# EAGLE design TiNRS-O&C-Homage (EAGLE 7.7.0)

## Sheet 1 of 2
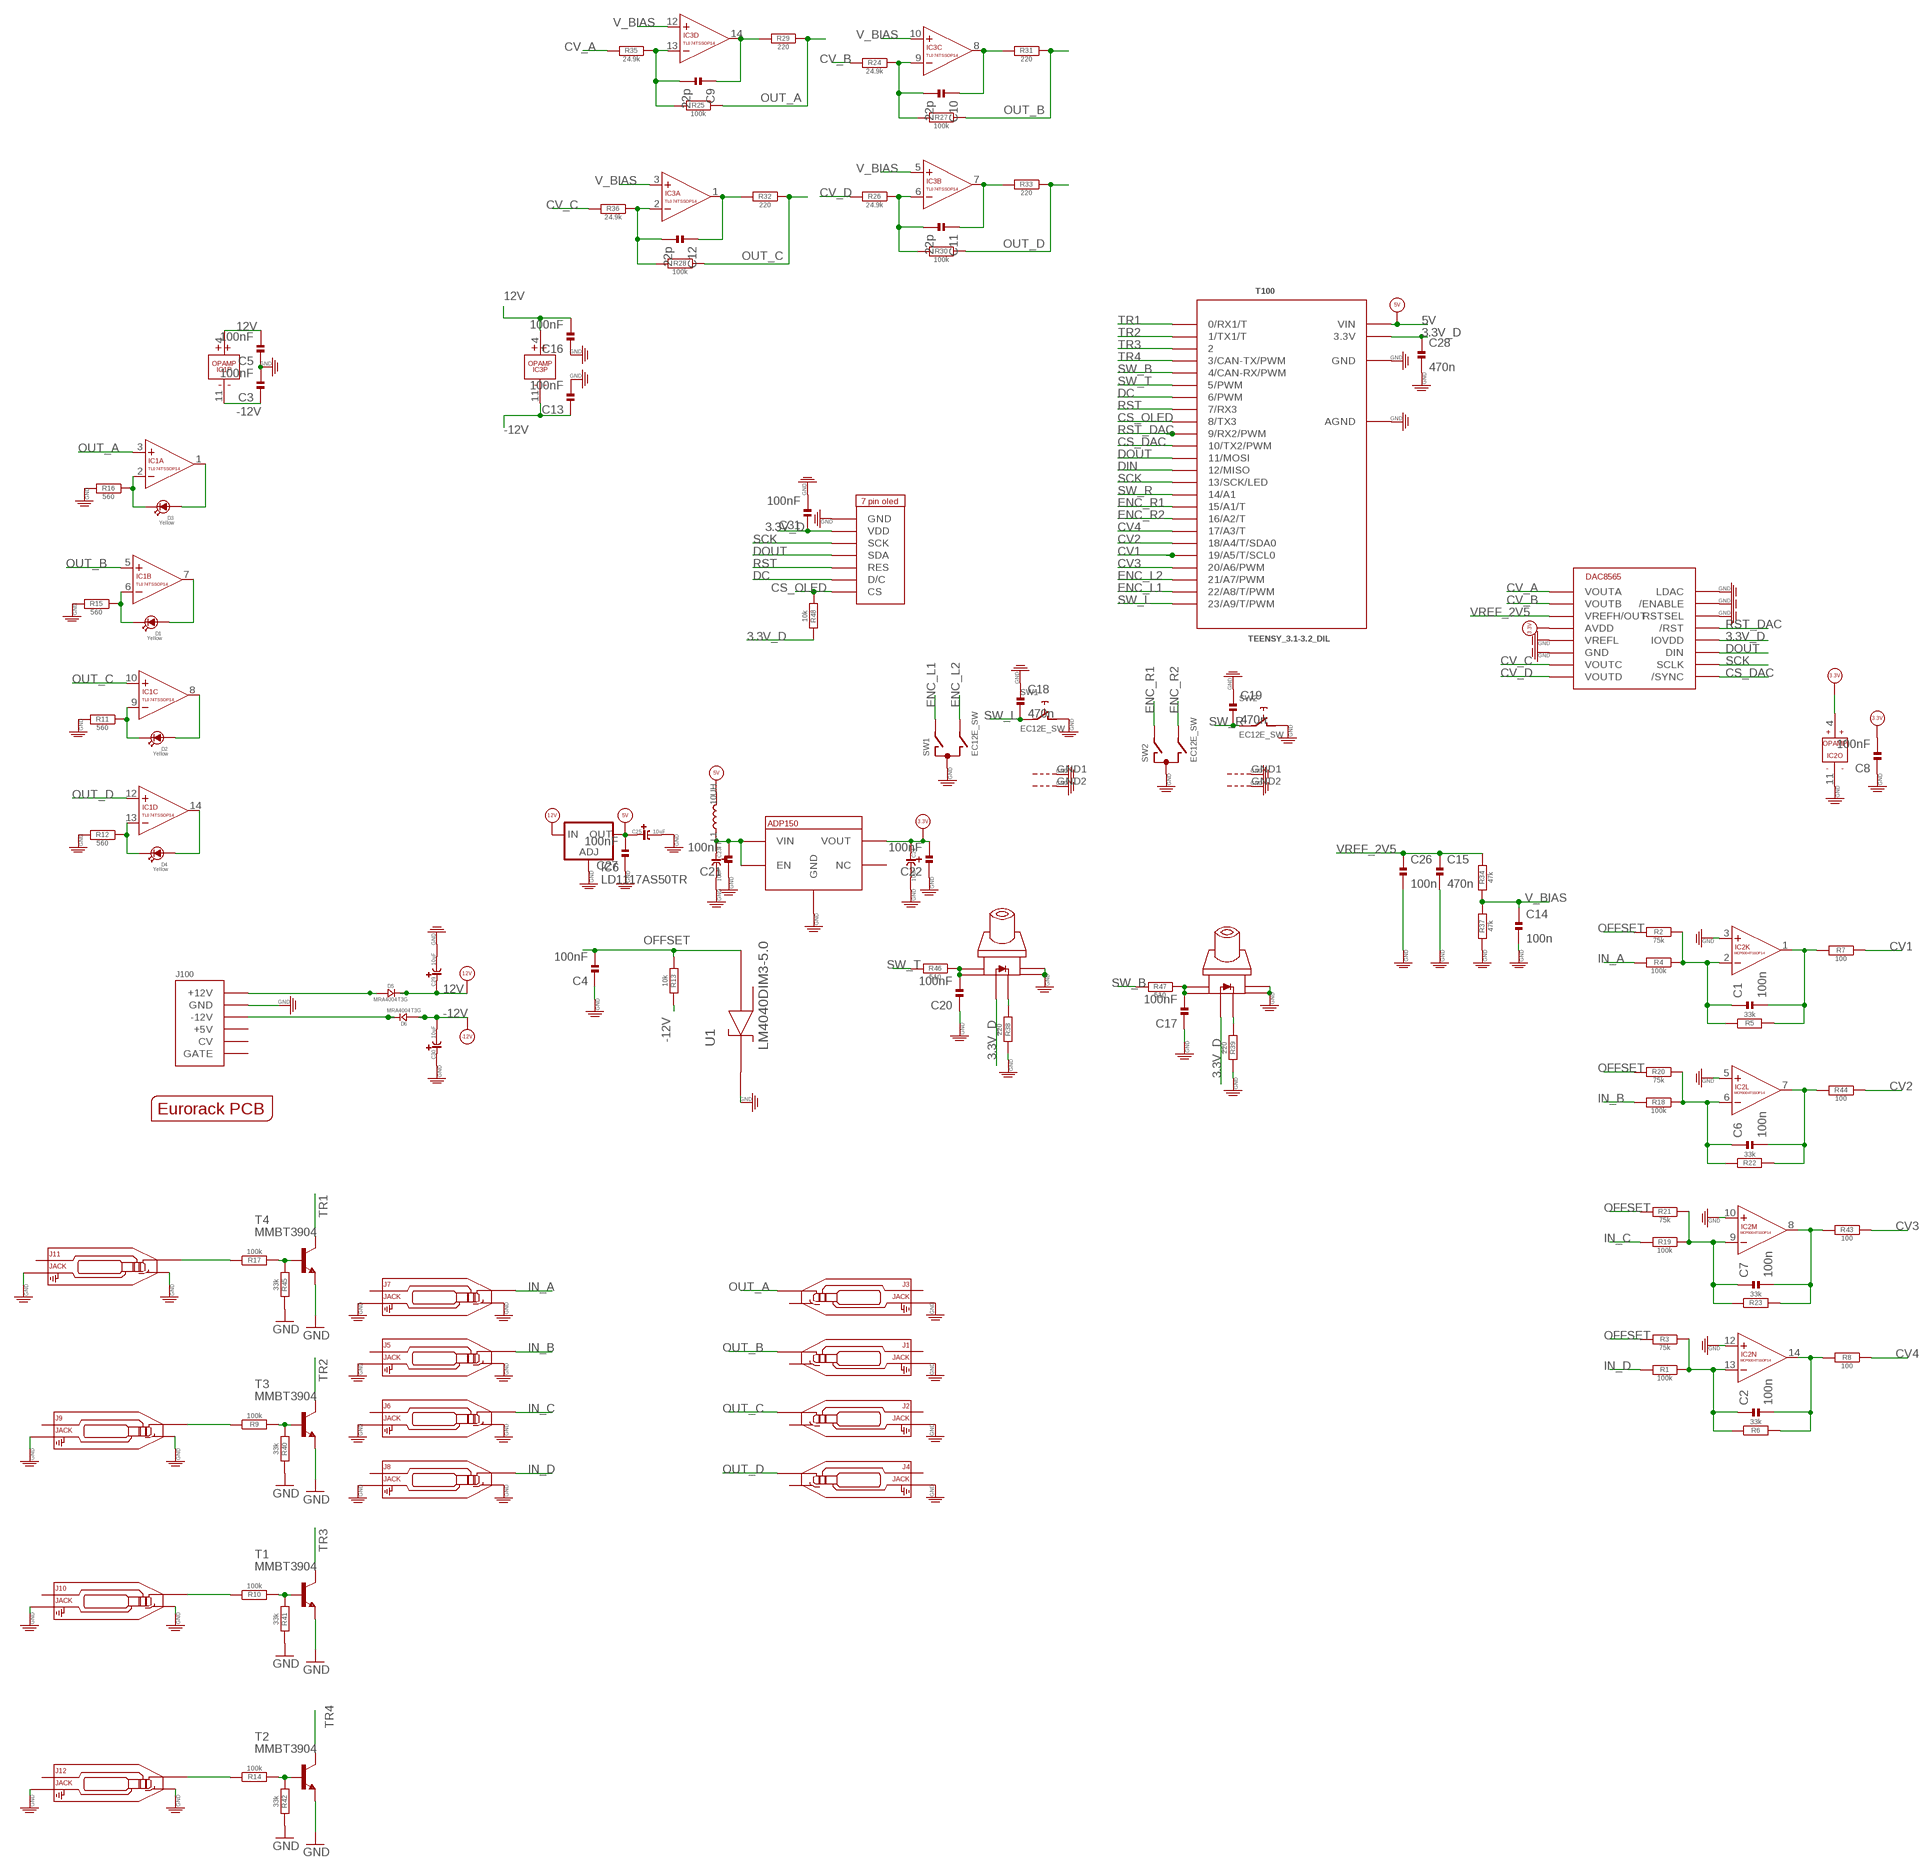
[diagram p0: schematic, sheet 1]

### Parts
C1  100n  C-EUC0402  [C0402]
C2  100n  C-EUC0402  [C0402]
C3  100nF  C-EUC0402  [C0402]
C4  100nF  C-EUC0402  [C0402]
C5  100nF  C-EUC0402  [C0402]
C6  100n  C-EUC0402  [C0402]
C7  100n  C-EUC0402  [C0402]
C8  100nF  C-EUC0402  [C0402]
C9  22p  C-EUC0402  [C0402]
C10  22p  C-EUC0402  [C0402]
C11  22p  C-EUC0402  [C0402]
C12  22p  C-EUC0402  [C0402]
C13  100nF  C-EUC0402  [C0402]
C14  100n  C-EUC0402  [C0402]
C15  470n  C-EUC0402  [C0402]
C16  100nF  C-EUC0402  [C0402]
C17  100nF  C-EUC0402  [C0402]
C18  470n  C-EUC0402  [C0402]
C19  470n  C-EUC0402  [C0402]
C20  100nF  C-EUC0402  [C0402]
C21  100nF  C-EUC0402  [C0402]
C22  100nF  C-EUC0402  [C0402]
C23  10uF  C-POLAR-A  [CASE-A_3216]
C24  10uF  C-POLAR-A  [CASE-A_3216]
C25  10uF  C-POLAR-A  [CASE-A_3216]
C26  100n  C-EUC0402  [C0402]
C27  100nF  C-EUC0402  [C0402]
C28  470n  C-EUC0402  [C0402]
C29  10uF  C-POLAR-A  [CASE-A_3216]
C30  10uF  C-POLAR-A  [CASE-A_3216]
C31  100nF  C-EUC0402  [C0402]
D1  Yellow  LED3MM  [3MMLED]
D2  Yellow  LED3MM  [3MMLED]
D3  Yellow  LED3MM  [3MMLED]
D4  Yellow  LED3MM  [3MMLED]
D5  MRA4004T3G  D-SMA  [DO-214AC]
D6  MRA4004T3G  D-SMA  [DO-214AC]
IC1  TL074TSSOP14  [TSSOP14]
IC2  MCP6004TSSOP14  [TSSOP14]
IC3  TL074TSSOP14  [TSSOP14]
IC4  ADP1503.3  [SOT-23-5]
IC5  DAC8565  [TSSOP-16]
IC6  LD1117AS50TR  [SOT223]
J1  JACK  AUDIO-JACK_SMALLSYMBOL  [3.5MM-JACK-SWITCH-13MM-NOHOLES-TESTPAD]
J2  JACK  AUDIO-JACK_SMALLSYMBOL  [3.5MM-JACK-SWITCH-13MM-NOHOLES-TESTPAD]
J3  JACK  AUDIO-JACK_SMALLSYMBOL  [3.5MM-JACK-SWITCH-13MM-NOHOLES-TESTPAD]
J4  JACK  AUDIO-JACK_SMALLSYMBOL  [3.5MM-JACK-SWITCH-13MM-NOHOLES-TESTPAD]
J5  JACK  AUDIO-JACK_SMALLSYMBOL  [3.5MM-JACK-SWITCH-13MM-NOHOLES-TESTPAD]
J6  JACK  AUDIO-JACK_SMALLSYMBOL  [3.5MM-JACK-SWITCH-13MM-NOHOLES-TESTPAD]
J7  JACK  AUDIO-JACK_SMALLSYMBOL  [3.5MM-JACK-SWITCH-13MM-NOHOLES-TESTPAD]
J8  JACK  AUDIO-JACK_SMALLSYMBOL  [3.5MM-JACK-SWITCH-13MM-NOHOLES-TESTPAD]
J9  JACK  AUDIO-JACK_SMALLSYMBOL  [3.5MM-JACK-SWITCH-13MM-NOHOLES-TESTPAD]
J10  JACK  AUDIO-JACK_SMALLSYMBOL  [3.5MM-JACK-SWITCH-13MM-NOHOLES-TESTPAD]
J11  JACK  AUDIO-JACK_SMALLSYMBOL  [3.5MM-JACK-SWITCH-13MM-NOHOLES-TESTPAD]
J12  JACK  AUDIO-JACK_SMALLSYMBOL  [3.5MM-JACK-SWITCH-13MM-NOHOLES-TESTPAD]
J100  POWER_SHROUDED_NOTEXT  [POWER_16_SHROUDED_NOTEXT]
L1  10UH  L-0805  [L0805]
OLED1  7PIN_SPI_OLED1.3"  [1.3"_7PIN_OLED]
PCB1  EURORACK_PCB8HP  [EURORACK8HPPCB]
R1  100k  R-EU_R0402  [R0402]
R2  75k  R-EU_R0402  [R0402]
R3  75k  R-EU_R0402  [R0402]
R4  100k  R-EU_R0402  [R0402]
R5  33k  R-EU_R0402  [R0402]
R6  33k  R-EU_R0402  [R0402]
R7  100  R-EU_R0402  [R0402]
R8  100  R-EU_R0402  [R0402]
R9  100k  R-EU_R0402  [R0402]
R10  100k  R-EU_R0402  [R0402]
R11  560  R-EU_R0402  [R0402]
R12  560  R-EU_R0402  [R0402]
R13  10k  R-EU_R0402  [R0402]
R14  100k  R-EU_R0402  [R0402]
R15  560  R-EU_R0402  [R0402]
R16  560  R-EU_R0402  [R0402]
R17  100k  R-EU_R0402  [R0402]
R18  100k  R-EU_R0402  [R0402]
R19  100k  R-EU_R0402  [R0402]
R20  75k  R-EU_R0402  [R0402]
R21  75k  R-EU_R0402  [R0402]
R22  33k  R-EU_R0402  [R0402]
R23  33k  R-EU_R0402  [R0402]
R24  24.9k  R-EU_R0402  [R0402]
R25  100k  R-EU_R0402  [R0402]
R26  24.9k  R-EU_R0402  [R0402]
R27  100k  R-EU_R0402  [R0402]
R28  100k  R-EU_R0402  [R0402]
R29  220  R-EU_R0402  [R0402]
R30  100k  R-EU_R0402  [R0402]
R31  220  R-EU_R0402  [R0402]
R32  220  R-EU_R0402  [R0402]
R33  220  R-EU_R0402  [R0402]
R34  47k  R-EU_R0402  [R0402]
R35  24.9k  R-EU_R0402  [R0402]
R36  24.9k  R-EU_R0402  [R0402]
R37  47k  R-EU_R0402  [R0402]
R38  220  R-EU_R0402  [R0402]
R39  220  R-EU_R0402  [R0402]
R40  33k  R-EU_R0402  [R0402]
R41  33k  R-EU_R0402  [R0402]
R42  33k  R-EU_R0402  [R0402]
R43  100  R-EU_R0402  [R0402]
R44  100  R-EU_R0402  [R0402]
R45  33k  R-EU_R0402  [R0402]
R46  510  R-EU_R0402  [R0402]
R47  510  R-EU_R0402  [R0402]
R48  10k  R-EU_R0402  [R0402]
S1  SWITCH_W_LED_PB6149L-X-102YELLOW  [PB6149L]
S2  SWITCH_W_LED_PB6149L-X-102YELLOW  [PB6149L]
SW1  EC12E_SW  [ALPS_EC12E_SW]
SW2  EC12E_SW  [ALPS_EC12E_SW]
T1  MMBT3904  MMBT3904LT1-NPN-SOT23-BEC  [SOT23-BEC]
T2  MMBT3904  MMBT3904LT1-NPN-SOT23-BEC  [SOT23-BEC]
T3  MMBT3904  MMBT3904LT1-NPN-SOT23-BEC  [SOT23-BEC]
T4  MMBT3904  MMBT3904LT1-NPN-SOT23-BEC  [SOT23-BEC]
T100  TEENSY_3.1-3.2_DIL  [TEENSY_3.0-3.2&LC_DIL]
U1  LM4040DIM3-5.0  [SOT95P237X112-3N]

### Nets
3.3V [heavypower]: C8.2 C22.2 C24.+ IC2.4(O:V+) IC4.5(VOUT) IC5.P$4(AVDD)
3.3V_D [heavypower]: C28.1 C31.1 IC5.P$12(IOVDD) OLED1.P$2(VDD) R48.1 S1.LEDPOS(POS) S2.LEDPOS(POS) T100.3.3V
5V [heavypower]: C25.+ C27.2 IC6.2(OUT) IC6.4(OUT) L1.2 T100.VIN
12V [heavypower]: C5.2 C16.2 C29.+ D5.2(-) IC1.4(P:V+) IC3.4(P:V+) IC6.3(IN)
-12V [heavypower]: C3.1 C13.1 C30.- D6.1(+) IC1.11(P:V-) IC3.11(P:V-) R13.1
CS_DAC: IC5.P$9(/SYNC) T100.10(10/TX2/PWM)
CS_OLED: OLED1.P$7(CS) R48.2 T100.8(8/TX3)
CV1: R7.1 T100.19/A5(19/A5/T/SCL0)
CV2: R44.1 T100.18/A4(18/A4/T/SDA0)
CV3: R43.1 T100.20/A6(20/A6/PWM)
CV4: R8.1 T100.17/A3(17/A3/T)
CV_A: IC5.P$1(VOUTA) R35.2
CV_B: IC5.P$2(VOUTB) R24.2
CV_C: IC5.P$7(VOUTC) R36.2
CV_D: IC5.P$8(VOUTD) R26.2
DC: OLED1.P$6(D/C) T100.6(6/PWM)
DIN: T100.12(12/MISO)
DOUT: IC5.P$11(DIN) OLED1.P$4(SDA) T100.11(11/MOSI)
ENC_L1: SW1.A T100.22/A8(22/A8/T/PWM)
ENC_L2: SW1.B T100.21/A7(21/A7/PWM)
ENC_R1: SW2.A T100.15/A1(15/A1/T)
ENC_R2: SW2.B T100.16/A2(16/A2/T)
GND: C3.2 C4.1 C5.1 C8.1 C13.2 C14.2 C15.2 C16.1 C17.1 C18.1 C19.1 C20.1 C21.1 C22.1 C23.- C24.- C25.- C26.2 C27.1 C28.2 C29.- C30.+ C31.2 IC2.3(K:+IN) IC2.5(L:+IN) IC2.10(M:+IN) IC2.11(O:V-) IC2.12(N:+IN) IC4.2(GND) IC5.P$5(VREFL) IC5.P$6(GND) IC5.P$14(RSTSEL) IC5.P$15(/ENABLE) IC5.P$16(LDAC) IC6.1(ADJ) J1.RING_B@1(RING) J1.RING_T@3(RING) J2.RING_B@1(RING) J2.RING_T@3(RING) J3.RING_B@1(RING) J3.RING_T@3(RING) J4.RING_B@1(RING) J4.RING_T@3(RING) J5.RING_B@1(RING) J5.RING_T@3(RING) J5.SWITCH_B@1(SWITCH) J5.SWITCH_T@3(SWITCH) J6.RING_B@1(RING) J6.RING_T@3(RING) J6.SWITCH_B@1(SWITCH) J6.SWITCH_T@3(SWITCH) J7.RING_B@1(RING) J7.RING_T@3(RING) J7.SWITCH_B@1(SWITCH) J7.SWITCH_T@3(SWITCH) J8.RING_B@1(RING) J8.RING_T@3(RING) J8.SWITCH_B@1(SWITCH) J8.SWITCH_T@3(SWITCH) J9.RING_B@1(RING) J9.RING_T@3(RING) J9.SWITCH_B@1(SWITCH) J9.SWITCH_T@3(SWITCH) J10.RING_B@1(RING) J10.RING_T@3(RING) J10.SWITCH_B@1(SWITCH) J10.SWITCH_T@3(SWITCH) J11.RING_B@1(RING) J11.RING_T@3(RING) J11.SWITCH_B@1(SWITCH) J11.SWITCH_T@3(SWITCH) J12.RING_B@1(RING) J12.RING_T@3(RING) J12.SWITCH_B@1(SWITCH) J12.SWITCH_T@3(SWITCH) J100.3(GND) J100.4(GND) J100.5(GND) J100.6(GND) J100.7(GND) J100.8(GND) OLED1.P$1(GND) R11.2 R12.2 R15.2 R16.2 R37.2 R38.1 R39.1 R40.1 R41.1 R42.1 R45.1 S1.3 S1.4 S2.3 S2.4 SW1.C SW1.D SW1.GND1(G) SW1.GND2(G) SW2.C SW2.D SW2.GND1(G) SW2.GND2(G) T1.E T2.E T3.E T4.E T100.AGND T100.GND U1.1(CATHODE)
IN_A: J7.TIP_B@1(TIP) J7.TIP_T@3(TIP) R4.2
IN_B: J5.TIP_B@1(TIP) J5.TIP_T@3(TIP) R18.2
IN_C: J6.TIP_B@1(TIP) J6.TIP_T@3(TIP) R19.2
IN_D: J8.TIP_B@1(TIP) J8.TIP_T@3(TIP) R1.2
N$1: R38.2 S1.LEDNEG(NEG)
N$2: R39.2 S2.LEDNEG(NEG)
N$3: C20.2 R46.1 S1.1 S1.2
N$4: C17.2 R47.1 S2.1 S2.2
N$6: R17.2 R45.2 T4.B
N$7: R9.2 R40.2 T3.B
N$8: J11.TIP_B@1(TIP) J11.TIP_T@3(TIP) R17.1
N$9: J9.TIP_B@1(TIP) J9.TIP_T@3(TIP) R9.1
N$10: R10.2 R41.2 T1.B
N$11: J10.TIP_B@1(TIP) J10.TIP_T@3(TIP) R10.1
N$12: R14.2 R42.2 T2.B
N$13: J12.TIP_B@1(TIP) J12.TIP_T@3(TIP) R14.1
N$14: C12.2 IC3.2(A:-IN) R28.2 R36.1
N$15: C12.1 IC3.1(A:OUT) R32.2
N$16: D1.- IC1.6(B:-IN) R15.1
N$17: C11.2 IC3.6(B:-IN) R26.1 R30.2
N$18: C11.1 IC3.7(B:OUT) R33.2
N$19: D1.+ IC1.7(B:OUT)
N$20: C10.2 IC3.9(C:-IN) R24.1 R27.2
N$21: C10.1 IC3.8(C:OUT) R31.2
N$22: D2.- IC1.9(C:-IN) R11.1
N$23: C9.2 IC3.13(D:-IN) R25.2 R35.1
N$24: C9.1 IC3.14(D:OUT) R29.2
N$25: D2.+ IC1.8(C:OUT)
N$26: D4.- IC1.13(D:-IN) R12.1
N$27 [heavypower]: C21.2 C23.+ IC4.1(VIN) IC4.3(EN) L1.1
N$28 [heavypower]: D5.1(+) J100.9(+12V) J100.10(+12V)
N$29: D4.+ IC1.14(D:OUT)
N$30: C6.2 IC2.7(L:OUT) R22.2 R44.2
N$31: C1.2 IC2.1(K:OUT) R5.2 R7.2
N$32: C1.1 IC2.2(K:-IN) R2.1 R4.1 R5.1
N$33: C6.1 IC2.6(L:-IN) R18.1 R20.1 R22.1
N$35: C7.2 IC2.8(M:OUT) R23.2 R43.2
N$37: C7.1 IC2.9(M:-IN) R19.1 R21.1 R23.1
N$38: C2.2 IC2.14(N:OUT) R6.2 R8.2
N$39: C2.1 IC2.13(N:-IN) R1.1 R3.1 R6.1
N$44: D3.- IC1.2(A:-IN) R16.1
N$64 [heavypower]: D6.2(-) J100.1(-12V) J100.2(-12V)
N$77: D3.+ IC1.1(A:OUT)
OFFSET [heavypower]: C4.2 R2.2 R3.2 R13.2 R20.2 R21.2 U1.2(ANODE)
OUT_A: IC1.3(A:+IN) J3.TIP_B@1(TIP) J3.TIP_T@3(TIP) R25.1 R29.1
OUT_B: IC1.5(B:+IN) J1.TIP_B@1(TIP) J1.TIP_T@3(TIP) R27.1 R31.1
OUT_C: IC1.10(C:+IN) J2.TIP_B@1(TIP) J2.TIP_T@3(TIP) R28.1 R32.1
OUT_D: IC1.12(D:+IN) J4.TIP_B@1(TIP) J4.TIP_T@3(TIP) R30.1 R33.1
RST: OLED1.P$5(RES) T100.7(7/RX3)
RST_DAC: IC5.P$13(/RST) T100.9(9/RX2/PWM)
SCK: IC5.P$10(SCLK) OLED1.P$3(SCK) T100.13(13/SCK/LED)
SW_B: R47.2 T100.4(4/CAN-RX/PWM)
SW_L: C18.2 SW1.E T100.23/A9(23/A9/T/PWM)
SW_R: C19.2 SW2.E T100.14/A0(14/A1)
SW_T: R46.2 T100.5(5/PWM)
TR1: T4.C T100.0(0/RX1/T)
TR2: T3.C T100.1(1/TX1/T)
TR3: T1.C T100.2
TR4: T2.C T100.3(3/CAN-TX/PWM)
V_BIAS: C14.1 IC3.3(A:+IN) IC3.5(B:+IN) IC3.10(C:+IN) IC3.12(D:+IN) R34.2 R37.1
VREF_2V5: C15.1 C26.1 IC5.P$3(VREFH/OUT) R34.1
Unconnected: IC4.4(NC) J1.SECOND_B@1(SECOND) J1.SECOND_T@3(SECOND) J1.SWITCH_B@1(SWITCH) J1.SWITCH_T@3(SWITCH) J2.SECOND_B@1(SECOND) J2.SECOND_T@3(SECOND) J2.SWITCH_B@1(SWITCH) J2.SWITCH_T@3(SWITCH) J3.SECOND_B@1(SECOND) J3.SECOND_T@3(SECOND) J3.SWITCH_B@1(SWITCH) J3.SWITCH_T@3(SWITCH) J4.SECOND_B@1(SECOND) J4.SECOND_T@3(SECOND) J4.SWITCH_B@1(SWITCH) J4.SWITCH_T@3(SWITCH) J5.SECOND_B@1(SECOND) J5.SECOND_T@3(SECOND) J6.SECOND_B@1(SECOND) J6.SECOND_T@3(SECOND) J7.SECOND_B@1(SECOND) J7.SECOND_T@3(SECOND) J8.SECOND_B@1(SECOND) J8.SECOND_T@3(SECOND) J9.SECOND_B@1(SECOND) J9.SECOND_T@3(SECOND) J10.SECOND_B@1(SECOND) J10.SECOND_T@3(SECOND) J11.SECOND_B@1(SECOND) J11.SECOND_T@3(SECOND) J12.SECOND_B@1(SECOND) J12.SECOND_T@3(SECOND) J100.11(+5V) J100.12(+5V) J100.13(CV) J100.14(CV) J100.15(GATE) J100.16(GATE) U1.3(NC)

## Sheet 2 of 2

## Library data of the parts
C1-C3 C5-C7 C9-C16 C18 C19 C26 C28 = resistor:C-EU: CAPACITOR, European symbol
C4 C8 C17 C20-C22 C27 C31 = resistor:C-EU: CAPACITOR, European symbol; MF: AVX; MPN: 06035C104KAT2A; OC_FARNELL: 1301804
C23-C25 C29 C30 = EurorackModularParts:C-POLAR*
D1 = EurorackModularParts:LED*: LED; DESC: B
D2 = EurorackModularParts:LED*: LED; DESC: C
D3 = EurorackModularParts:LED*: LED; DESC: A
D4 = EurorackModularParts:LED*: LED; DESC: D
D5 D6 = OPL:D*: DIODE; MF: VISHAY; MPN: US1G-E3/5AT; OC_FARNELL: 9551824
IC1 IC3 = EurorackModularParts:TL074: OP AMP
IC2 = EurorackModularParts:MCP6004
IC4 = zephod-components:ADP150
IC5 = zephod-components:DAC8565
IC6 = ld-components:LD1117A?*: Low drop fixed and adjustable positive voltage regulators 1 A Source: http://www.st.com/stonline/products/literature/ds/7194/ld1117axx.pdf
J1 = EurorackModularParts:AUDIO-JACK_SMALLSYMBOL: Switching Mono 3.5mm Audio Jack from Erthenvar.; DESC: O 2
J2 = EurorackModularParts:AUDIO-JACK_SMALLSYMBOL: Switching Mono 3.5mm Audio Jack from Erthenvar.; DESC: O 3
J3 = EurorackModularParts:AUDIO-JACK_SMALLSYMBOL: Switching Mono 3.5mm Audio Jack from Erthenvar.; DESC: O 1
J4 = EurorackModularParts:AUDIO-JACK_SMALLSYMBOL: Switching Mono 3.5mm Audio Jack from Erthenvar.; DESC: O 4
J5 = EurorackModularParts:AUDIO-JACK_SMALLSYMBOL: Switching Mono 3.5mm Audio Jack from Erthenvar.; DESC: C 2
J6 = EurorackModularParts:AUDIO-JACK_SMALLSYMBOL: Switching Mono 3.5mm Audio Jack from Erthenvar.; DESC: C 3
J7 = EurorackModularParts:AUDIO-JACK_SMALLSYMBOL: Switching Mono 3.5mm Audio Jack from Erthenvar.; DESC: C 1
J8 = EurorackModularParts:AUDIO-JACK_SMALLSYMBOL: Switching Mono 3.5mm Audio Jack from Erthenvar.; DESC: C 4
J9 = EurorackModularParts:AUDIO-JACK_SMALLSYMBOL: Switching Mono 3.5mm Audio Jack from Erthenvar.; DESC: G 2
J10 = EurorackModularParts:AUDIO-JACK_SMALLSYMBOL: Switching Mono 3.5mm Audio Jack from Erthenvar.; DESC: G 3
J11 = EurorackModularParts:AUDIO-JACK_SMALLSYMBOL: Switching Mono 3.5mm Audio Jack from Erthenvar.; DESC: G 1
J12 = EurorackModularParts:AUDIO-JACK_SMALLSYMBOL: Switching Mono 3.5mm Audio Jack from Erthenvar.; DESC: G 4
J100 = EurorackModularParts:POWER
L1 = OPL:L*
OLED1 = zephod-components:7PIN_SPI_OLED
PCB1 = EurorackModularParts:EURORACK_PCB
R1-R48 = resistor:R-EU_: RESISTOR, European symbol; OC_FARNELL: unknown
S1 S2 = zephod-components:SWITCH_W_LED_PB6149L-X-102
SW1 SW2 = switch-alps:EC12E_SW: ALPS rotary Encoder EC12E series with switch; MPN: EC12E2424407; OC_FARNELL: 1520813; OC_NEWARK: 74M1068
T1-T4 = transistor:*-NPN-: NPN Transistror BF959 corrected 2008.03.06; MF: NXP; MPN: PMBT3904,215; OC_FARNELL: 2336795
T100 = Teensy_3_and_LC_Series_Boards_v1.4:TEENSY_3.1-3.2_DIL: Teensy 3.1 or 3.2 in a DIL Layout.
U1 = FarnellThings:LM4040DIM3-5.0: IC, Precision Micropower Shunt Voltage Reference, 5V,SOT-23-3; MF: TEXAS INSTRUMENTS; MPN: LM4040DIM3-5.0; OC_FARNELL: 9778330; OC_NEWARK: 97K3489; PACKAGE: SOT-23-3; SUPPLIER: TEXAS INSTRUMENTS

## Net classes
0 default: width 0.203 mm
1 heavypower: width 0.381 mm

## Board
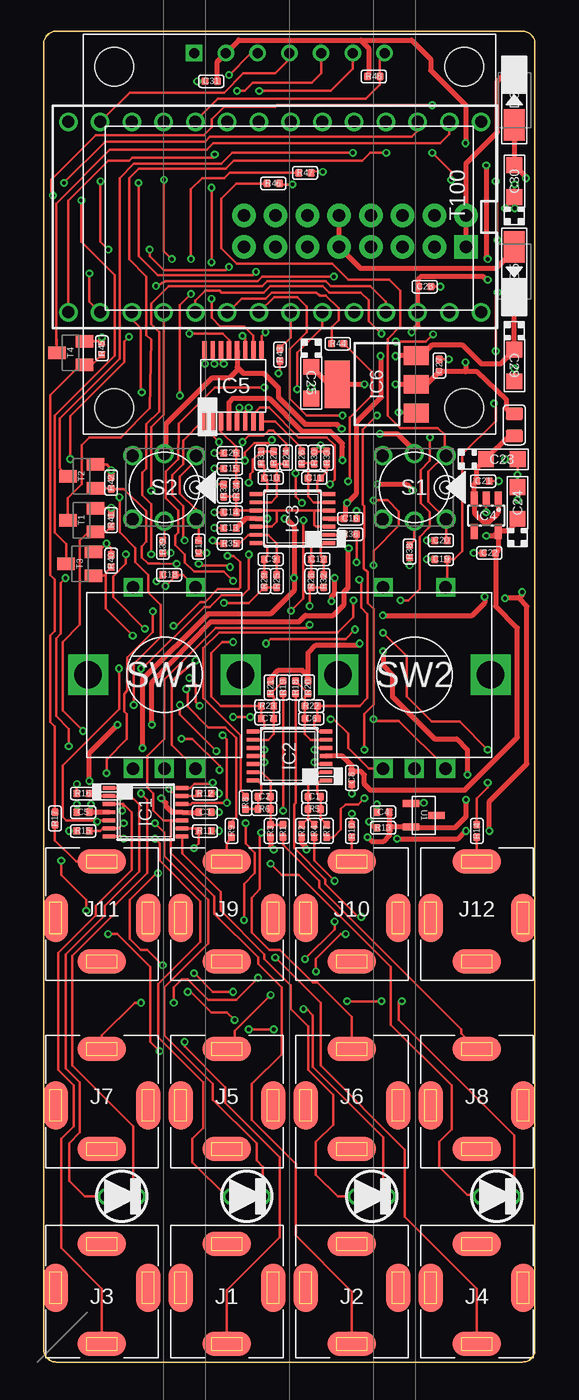
[diagram p1: board, top side]
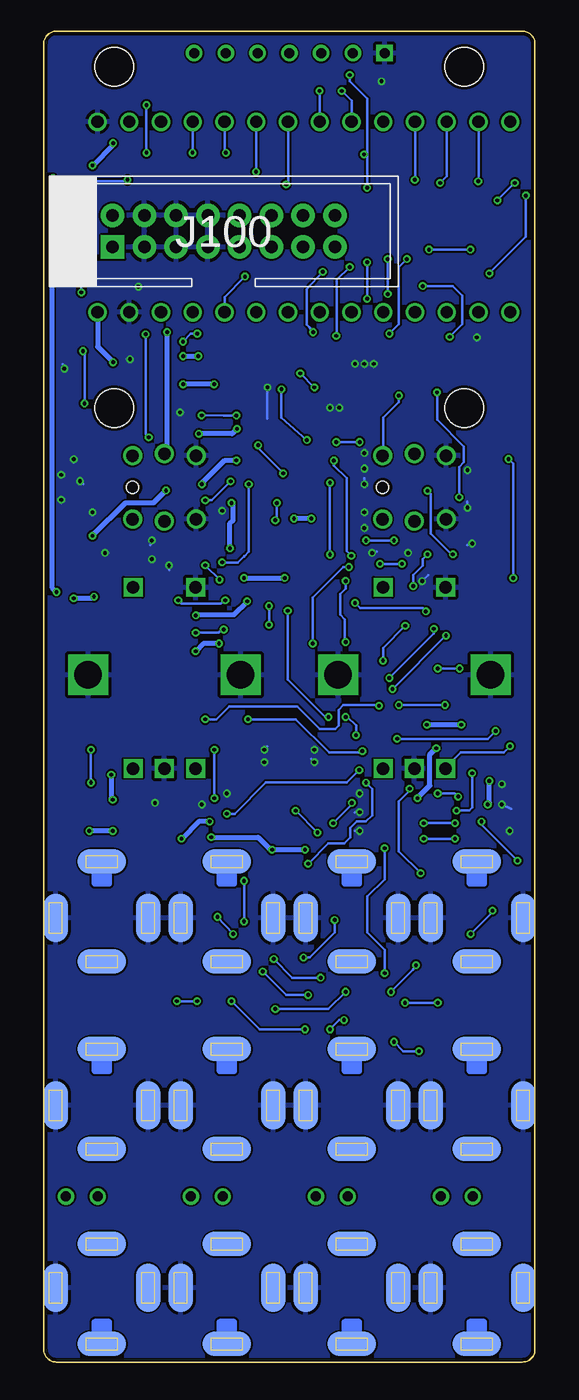
[diagram p2: board, bottom side, seen from below]

Size 39.3 x 106.5 mm. Coordinates in mm from the lower left corner, seen from the top.
Copper layers (1*16): Top 0.035mm / dielectric 1.5mm / Bottom 0.035mm
Design rules "ITEADstudio_DRC": minimum track width 6mil, minimum drill 12mil, track to track 6mil, track to pad 6mil, pad to pad 6mil, via to via 6mil, smd to smd 0mil, copper to edge 10mil, drill to drill 10mil, minimum pad ring 10mil, minimum via ring 6mil, stop-mask expansion 2mil, vias tented up to drill 100mil, thermal gap 10mil

### Footprints (pad centres in the part's own frame; a part is rotated, then mirrored left to right if it is on the bottom)
C0402 = smd 0.6 x 0.6: 1 -0.5,0; 2 0.5,0
CASE-A_3216 = smd 1.27 x 1.27: + -1.27,0; - 1.27,0
3MMLED = drill 0.8: + -1.27,0; - 1.27,0
DO-214AC = smd 2.5 x 1.7: 1 -2,0; 2 2,0
TSSOP14 = smd 0.305 x 0.991: 1 -1.95,-2.918; 2 -1.3,-2.918; 3 -0.65,-2.918; 4 0,-2.918; 5 0.65,-2.918; 6 1.3,-2.918; 7 1.95,-2.918; 8 1.95,2.918; 9 1.3,2.918; 10 0.65,2.918; 11 0,2.918; 12 -0.65,2.918; 13 -1.3,2.918; 14 -1.95,2.918
SOT-23-5 = smd 0.55 x 1.2: 1 -0.95,-1.3; 2 0,-1.3; 3 0.95,-1.3; 4 0.95,1.3; 5 -0.95,1.3
TSSOP-16 = smd 0.35 x 1.4: P$1 -2.275,-2.875; P$2 -1.625,-2.875; P$3 -0.975,-2.875; P$4 -0.325,-2.875; P$5 0.325,-2.875; P$6 0.975,-2.875; P$7 1.625,-2.875; P$8 2.275,-2.875; P$9 2.275,2.875; P$10 1.625,2.875; P$11 0.975,2.875; P$12 0.325,2.875; P$13 -0.325,2.875; P$14 -0.975,2.875; P$15 -1.625,2.875; P$16 -2.275,2.875
SOT223 = smd 1.5 x 2: 1 -2.3,-3.15; 2 0,-3.15; 3 2.3,-3.15 | smd 3.8 x 2: 4 0,3.15
3.5MM-JACK-SWITCH-13MM-NOHOLES-TESTPAD = smd 1.95 x 3.85 bottom: RING_B@1 -3.7,-0.7; SWITCH_B@1 3.7,-0.7 | smd 1.95 x 3.85: RING_T@3 -3.7,-0.7; SWITCH_T@3 3.7,-0.7 | smd 3.85 x 1.95 bottom: SECOND_B@1 0,-4.2; TIP_B@1 0,3.8 | smd 3.85 x 1.95: SECOND_T@3 0,-4.2; TIP_T@3 0,3.8
POWER_16_SHROUDED_NOTEXT = drill 1.016 pad 1.88 square: 1 -8.89,-1.27 | drill 1.016 pad 1.88: 2 -8.89,1.27; 3 -6.35,-1.27; 4 -6.35,1.27; 5 -3.81,-1.27; 6 -3.81,1.27; 7 -1.27,-1.27; 8 -1.27,1.27; 9 1.27,-1.27; 10 1.27,1.27; 11 3.81,-1.27; 12 3.81,1.27; 13 6.35,-1.27; 14 6.35,1.27; 15 8.89,-1.27; 16 8.89,1.27
L0805 = smd 1.016 x 1.397: 1 -0.889,0; 2 0.889,0
1.3"_7PIN_OLED = drill 0.8 square: P$1 -7.62,-1.5 | drill 0.8: P$2 -5.08,-1.5; P$3 -2.54,-1.5; P$4 0,-1.5; P$5 2.54,-1.5; P$6 5.08,-1.5; P$7 7.62,-1.5 | hole 3.1: -14,-2.6; 14,-2.6; 14,-29.9; -14,-29.9
R0402 = smd 0.6 x 0.6: 1 -0.5,0; 2 0.5,0
PB6149L = drill 1: 1 2.54,2.54; 2 2.54,-2.54; 3 -2.54,2.54; 4 -2.54,-2.54; LEDNEG 0,-2.7; LEDPOS 0,2.7 | hole 1: 2.54,0
ALPS_EC12E_SW = drill 1 square: A -2.5,-7.5; B 2.5,-7.5; C 0,-7.5; D -2.5,7; E 2.5,7 | drill 2.2 square: GND1 -6.1,0; GND2 6.1,0
SOT23-BEC = smd 1 x 1.4: B -0.95,-1.1; C 0,1.1; E 0.95,-1.1
TEENSY_3.0-3.2&LC_DIL = drill 0.965: 0 -7.62,13.97; 1 -7.62,11.43; 2 -7.62,8.89; 3 -7.62,6.35; 3.3V 7.62,11.43; 4 -7.62,3.81; 5 -7.62,1.27; 6 -7.62,-1.27; 7 -7.62,-3.81; 8 -7.62,-6.35; 9 -7.62,-8.89; 10 -7.62,-11.43; 11 -7.62,-13.97; 12 -7.62,-16.51; 13 7.62,-16.51; 14/A0 7.62,-13.97; 15/A1 7.62,-11.43; 16/A2 7.62,-8.89; 17/A3 7.62,-6.35; 18/A4 7.62,-3.81; 19/A5 7.62,-1.27; 20/A6 7.62,1.27; 21/A7 7.62,3.81; 22/A8 7.62,6.35; 23/A9 7.62,8.89; AGND 7.62,13.97; GND -7.62,16.51; VIN 7.62,16.51
SOT95P237X112-3N = smd 1.321 x 0.559: 1 -1.016,0.94; 2 -1.016,-0.94; 3 1.016,0

### Placement (x,y rotation side)
C1  21.65,45.25 0 top
C2  17.65,45.25 180 top
C3  12.9,44 0 top
C4  27.15,44 0 top
C5  3.15,44 0 top
C6  21.4,51.5 0 top
C7  17.9,51.5 180 top
C8  24.65,46.75 90 top
C9  18.15,64.25 0 top
C10  18.15,70.75 0 top
C11  21.65,70.75 180 top
C12  21.9,64.25 180 top
C13  14.9,66.75 180 top
C14  14.9,68 180 top
C15  14.9,71.5 180 top
C16  24.52,67.5 180 top
C17  12.4,65.25 90 top
C18  10.02,63 0 top
C19  31.77,64.25 0 top
C20  31.77,65.75 0 top
C21  35.15,70.5 180 top
C22  35.65,64.75 0 top
C23  36.65,72.25 0 top
C24  37.9,68.75 90 top
C25  21.4,78.38 270 top
C26  14.9,72.75 180 top
C27  31.65,79.75 270 top
C28  30.48,86.06 0 top
C29  37.65,79.75 270 top
C30  37.65,94.5 90 top
C31  13.4,102.5 180 top
D1  16.25,13.25 0 top
D2  26.25,13.25 0 top
D3  6.25,13.25 0 top
D4  36.25,13.25 0 top
D5  37.65,87.25 270 top
D6  37.65,101 90 top
IC1  8.15,44 270 top
IC2  19.65,48.5 90 top
IC3  19.9,67.5 90 top
IC4  35.4,67.75 180 top
IC5  15.15,78.12 0 top
IC6  26.65,78.25 90 top
J1  14.65,5.25 180 top
J2  24.65,5.25 180 top
J3  4.65,5.25 180 top
J4  34.65,5.25 180 top
J5  14.65,21.25 0 top
J6  24.65,21.25 0 top
J7  4.65,21.25 0 top
J8  34.65,21.25 0 top
J9  14.65,36.25 0 top
J10  24.65,36.25 0 top
J11  4.65,36.25 0 top
J12  34.65,36.25 0 top
J100  24.9,90.5 0 bottom
L1  37.65,75 90 top
OLED1  19.65,106.25 0 top
PCB1  -0.5,0 0 top
R1  19.15,42.5 270 top
R2  20.65,42.5 270 top
R3  18.15,42.5 270 top
R4  21.65,42.5 270 top
R5  21.65,44.25 0 top
R6  17.65,44.25 180 top
R7  22.65,42.5 90 top
R8  16.15,44.75 270 top
R9  15.02,42.5 90 top
R10  24.65,42.5 90 top
R11  12.9,42.5 0 top
R12  12.9,45.5 0 top
R13  27.15,42.75 0 top
R14  34.65,42.5 90 top
R15  3.15,42.5 180 top
R16  3.15,45.5 180 top
R17  0.9,43.5 90 top
R18  20.15,54 270 top
R19  19.15,54 270 top
R20  21.15,54 90 top
R21  18.15,54 90 top
R22  21.4,52.5 0 top
R23  17.9,52.5 180 top
R24  19.4,72.38 90 top
R25  18.65,62.5 90 top
R26  20.65,72.38 90 top
R27  18.4,72.38 270 top
R28  21.4,62.5 90 top
R29  17.65,62.5 90 top
R30  21.65,72.38 270 top
R31  17.4,72.38 270 top
R32  22.4,62.5 90 top
R33  22.65,72.38 270 top
R34  15.4,69.75 270 top
R35  14.9,65.5 180 top
R36  24.52,66.25 0 top
R37  14.4,69.75 90 top
R38  29.27,64.88 90 top
R39  9.52,65.25 90 top
R40  5.4,64.12 270 top
R41  5.4,67.38 270 top
R42  5.4,70.38 270 top
R43  18.9,80.62 270 top
R44  23.52,81.5 0 top
R45  4.65,81.12 270 top
R46  18.36,94.32 0 top
R47  20.9,95.17 0 top
R48  26.4,102.88 0 top
S1  29.65,70 0 top
S2  9.65,70 0 top
SW1  9.65,55 0 top
SW2  29.65,55 0 top
T1  3.02,67.38 90 top
T2  3.02,70.88 90 top
T3  2.9,63.88 90 top
T4  2.15,80.75 90 top
T100  18.49,91.63 270 top
U1  30.4,43.75 0 top

### Tracks (layer width: path | path; a pad name or v marks a point on that pad's centre or on a via)
3.3V  (via drill 0.3)
  Top 0.381: C24.+ 37.9,67.25 37.15,66.5 36.4,66.5 IC4.5 | IC4.5 36.35,64.95 C22.2 36.15,60.5 37.9,58.75 37.9,50 33.65,45.75 26.15,45.75 25.65,46.25 25.65,47 25.4,47.25 C8.2 24.65,47.75 23.9,48.5 IC2.4 | IC5.P$4 14.82,76.8 15.15,77.12 18.02,77.12 20.65,74.5 22.9,74.5 23.9,73.5 23.89,73.25 v23.89,72.15 | v26.65,70.25 29.02,70.25 v29.52,69.75 | v35.4,66.12 36.02,66.12 IC4.5
  Bottom 0.381: v23.89,72.15 24.86,72.14 26.65,70.34 v26.65,70.25 | v29.52,69.75 30.52,68.75 32.77,68.75 v35.4,66.12
3.3V_D  (via drill 0.3)
  Top 0.381: v29.43,82.42 29.94,82.93 29.94,83.99 T100.3.3V 29.92,86 C28.1 29.94,86.1 29.94,86.61 30.19,86.87 35.14,86.87 35.4,86.61 v35.52,86.61 | C31.1 13.9,104.08 OLED1.P$2 14.57,104.78 15.59,105.79 25.36,105.79 | 25.36,105.79 26,105.16 26,102.97 R48.1 | 25.36,105.79 29.43,105.79 30.95,104.27 30.95,103.38 33.75,100.58 v33.75,97.54 | v35.4,95.76 35.4,88.39 v35.52,88.27 | v23.84,74.68 23.46,75.06 20.92,75.06 18.76,77.22 18.76,77.98 17.62,79.12 15.97,79.12 15.47,79.61 IC5.P$12 15.47,79.39 14.82,78.74 13.43,78.74 9.74,75.06 9.74,72.79 S2.LEDPOS 9.62,72.73 | v26.89,74.3 28.29,74.3 29.43,73.15 29.43,72.92 S1.LEDPOS
  Bottom 0.381: v29.43,82.42 29.43,72.92 S1.LEDPOS | v33.75,97.54 33.75,97.41 v35.4,95.76 | v35.52,88.27 v35.52,86.61 | v23.84,74.68 24.22,74.3 v26.89,74.3
5V  (via drill 0.3)
  Top 0.381: L1.2 37.26,75.89 37.02,76.25 37.02,77 34.65,79.25 33.75,79.25 | 33.75,79.25 C27.2 30.65,78.25 IC6.2 v28.15,78.25 | v25.66,78.25 IC6.4 22.79,78.25 C25.+ | v33.75,80.01 33.75,79.25
  Bottom 0.381: v25.66,78.25 v28.15,78.25 | T100.VIN 35,81.26 v33.75,80.01
12V  (via drill 0.3)
  Top 0.381: IC3.4 C16.2 24.15,67.62 24.15,68.62 v24.27,68.75 25.02,69.5 25.02,75.25 25.05,75.25 27.02,77.22 27.02,80.42 v26.94,80.5 | 30.2,80.55 IC6.3 28.32,80.55 v28.15,80.5 | C5.2 IC1.4 3.9,44 3.77,44.12 v3.77,44.62 | 30.15,80.5 30.2,80.55 | 30.2,80.55 31.02,81.38 33.52,81.38 35.02,79.88 36.52,79.88 37.65,81 C29.+ D5.2 | v3.65,46.5 3.65,48.75 v5.9,51 | v24.4,65.12 24.4,65 24.35,64.9 24.35,61.98 24.02,61.65 24.02,60.62 23.15,59.75 20.93,59.75 20.42,59.25 13.4,59.25 8.65,54.38 v8.65,51
  Bottom 0.381: v3.77,44.62 3.65,44.75 v3.65,46.5 | v5.9,51 v8.65,51 | v24.4,65.12 24.4,67.12 24.15,67.38 24.15,68.62 v24.27,68.75 | v28.15,80.5 v26.94,80.5
-12V  (via drill 0.3)
  Top 0.381: C13.1 16.15,67.5 IC3.11 v17.9,67.5 | C3.1 IC1.11 10.27,44 9.77,44.5 9.77,44.75 v9.4,45.12 | v19.27,67.5 19.4,67.5 20.02,66.88 v20.02,62.75 20.02,61.75 18.15,59.87 13.15,59.87 7.9,54.62 v7.9,49.12 | R13.1 26.52,42.75 v26.02,43.25 | v28.27,41.88 33.15,41.88 v33.77,42.5 | v35.65,42.5 35.65,44.88 38.65,47.88 38.65,60.5 38.02,61.12 | 38.02,61.12 v36.9,61.12 | v35.27,61.25 35.27,60.75 34.27,59.75 v27.13,59.75 | v23.02,60.88 23.02,61.25 23.27,61.5 v23.27,62.75 | v38.27,61.62 38.27,61.38 38.02,61.12 | D6.1 C30.- 38.57,94.85 v38.57,94.74
  Bottom 0.381: v17.9,67.5 v19.27,67.5 | v9.4,45.12 8.4,46.12 8.4,48.62 v7.9,49.12 | v26.02,43.25 26.9,43.25 v28.27,41.88 | v33.77,42.5 v35.65,42.5 | v36.9,61.12 35.4,61.12 v35.27,61.25 | v23.02,60.88 24.09,59.82 27.02,59.82 27.09,59.75 v27.13,59.75 | v23.27,62.75 v20.02,62.75 | v38.27,61.62 38.65,62 38.65,94.67 v38.57,94.74
CS_DAC  (via drill 0.3)
  Top 0.203: IC5.P$9 17.42,82.1 v17.74,82.42 | v16.98,87.25 16.73,87 9.11,87 7.58,88.52 v7.58,94.36
  Bottom 0.203: T100.10 7.06,94.89 v7.58,94.36 | v16.98,87.25 18.25,85.85 18.25,83.03 18.27,83.01 18.07,82.8 v17.74,82.42
CS_OLED
  Top 0.203: OLED1.P$7 26.9,104.38 R48.2 26.89,102.86 26.89,102.23 25.75,101.09 13.93,101.09 12.14,99.29 T100.8
CV1  (via drill 0.3)
  Top 0.203: R7.1 23.15,42 23.77,42.62 23.77,44.25 24.15,44.62 25.15,44.62 v25.65,45.12 | v23.89,75.75 23.64,75.75 21.02,75.75 19.67,77.11 19.67,81.05 21.05,82.42 21.05,84.45 20.29,85.22 18.42,85.22 T100.19/A5 | v26.66,75.76 25.52,74.62 25.52,68.62 25.65,68.5 25.62,63.5 25.9,63.22 25.9,60.75 26.4,60.25 26.4,52.62 25.65,51.88 v25.65,49
  Bottom 0.203: v23.89,75.75 24.9,75.75 v26.66,75.76 | v25.65,45.12 v25.65,49
CV2
  Top 0.203: R44.1 23.02,82.81 23.59,83.38 23.59,84.33 22.57,85.34 22.06,85.34 21.81,85.6 18.25,85.6 17.74,85.09 15.84,85.09 15.46,84.71 14.76,84.01 T100.18/A4
CV3
  Top 0.203: 18.77,81.25 R43.1 19.76,81.98 T100.20/A6
CV4  (via drill 0.3)
  Top 0.203: R8.1 16.15,45.38 15.77,45.75 15.77,50.13 12.77,53.13 12.77,57.12 14.02,58.38 23.53,58.38 24.77,59.62 v24.77,60.96 | v30.9,74 30.9,72.12 30.15,71.38 30.15,68.75 30.9,68 30.9,66.88 30.78,66.75 30.06,66.04 30.06,61.85 29.17,60.96 v28.54,60.96 | T100.17/A3 12.14,84.94 12.92,85.72 14.06,85.72 14.19,85.6 17.62,85.6 18.13,86.11 22.32,86.11 22.82,85.6 25.36,85.6 26,84.96 26,83.31 v27.02,82.3 | v28.16,81.66 30.56,81.66 v31.15,82.25
  Bottom 0.203: v31.15,82.25 31.15,74.25 v30.9,74 | v24.77,60.96 25.16,60.71 28.29,60.71 v28.54,60.96 | v27.02,82.3 27.52,82.3 v28.16,81.66
CV_A  (via drill 0.3)
  Top 0.203: IC5.P$1 12.65,75.25 11.15,73.75 11.15,71.88 10.27,71 10.27,69.38 11.15,68.5 11.15,65.88 v11.27,65.75 | R35.2 13.77,65.5 v13.52,65.75
  Bottom 0.203: v13.52,65.75 v11.27,65.75
CV_B  (via drill 0.3)
  Top 0.203: IC5.P$2 13.52,74.12 v14.02,73.62 | R24.2 19.4,73.5 18.35,74.55 18,74.55 17.57,74.12 16.4,74.12 v15.9,73.62
  Bottom 0.203: v15.9,73.62 v14.02,73.62
CV_C  (via drill 0.3)
  Top 0.203: IC5.P$7 16.77,75.88 17.27,76.38 18.02,76.38 20.4,74 22.65,74 23.27,73.38 23.27,70.62 v22.9,70.25 | R36.2 v25.02,64
  Bottom 0.203: v25.02,64 23.77,64 23.27,64.5 23.27,64.47 22.9,64.84 22.9,68.75 22.89,68.99 22.89,69.49 v22.9,70.25
CV_D
  Top 0.203: IC5.P$8 18.52,75.25 20.52,73.25 R26.2
DC  (via drill 0.3)
  Top 0.203: v17.24,101.73 22.95,101.73 24.73,103.5 OLED1.P$6
  Bottom 0.203: T100.6 17.22,101.71 v17.24,101.73
DOUT  (via drill 0.3)
  Top 0.203: IC5.P$11 16.12,81.9 v15.9,82.12 | OLED1.P$4 19.65,104.27 18.51,103.12 15.97,103.12 14.44,101.6 6.87,101.6 T100.11 | v4.54,94.49 4.54,89.66 v5.17,89.03 | v8.47,89.03 8.47,88.52 9.62,87.38 14.57,87.38 v14.82,87.63
  Bottom 0.203: 15.77,82.25 v15.9,82.12 15.84,82.19 15.84,86.61 v14.82,87.63 | T100.11 4.52,95.14 v4.54,94.49 | v5.17,89.03 v8.47,89.03
ENC_L1  (via drill 0.3)
  Top 0.203: v2,49.28 2,50.67 0.98,51.69 0.98,57.91 1.36,58.29 1.36,62.36 v1.74,62.74 | v2.12,72.26 2.12,75.69 6.44,80.01 6.44,81.66 v6.82,82.04 | v23.21,86.87 17.49,86.87 17.11,86.49 9.74,86.49 v8.98,86.11
  Bottom 0.203: SW1.A 7.15,47.55 5.93,48.77 2.5,48.77 v2,49.28 | v1.74,62.74 1.74,71.88 v2.12,72.26 | v6.82,82.04 5.81,83.06 5.81,85.34 6.57,86.11 v8.98,86.11 | T100.22/A8 24.84,85.24 v23.21,86.87
ENC_L2  (via drill 0.3)
  Top 0.203: SW1.B 10.25,49.4 10.25,54.48 v12.16,56.13 | T100.21/A7 22.3,82.78 20.29,80.77 v20.29,77.85 | v18.25,73.79 18,73.53 16.86,73.53 16.09,72.77 v16.09,72.14 | v14.7,64.52 15.2,64.52 15.71,64.01 15.71,61.98 15.59,61.85 13.93,61.85 12.92,60.83 12.54,60.83 10.63,58.93 v10.38,58.93
  Bottom 0.203: v20.29,77.85 20.29,75.56 v18.25,73.79 | v16.09,72.14 16.09,71.75 15.08,70.74 15.08,64.9 v14.7,64.52 | v12.16,56.13 12.16,57.15 v10.38,58.93
ENC_R1  (via drill 0.3)
  Top 0.203: SW2.A 26,47.5 24.35,49.15 24.35,50.29 23.21,51.44 v22.95,51.44 | T100.15/A1 7.06,83.47 7.77,82.75 7.77,77.66 v7.84,77.6 | v10.89,52.58 10.89,51.82 v13.81,48.9 | v7.2,52.58 7.2,55.88 9.36,58.04 9.36,60.58 8.35,61.59 8.35,62.99 7.33,64.01 7.33,65.15 6.06,66.42 v6.06,69.22
  Bottom 0.203: v22.95,51.44 19.14,51.44 16.47,48.77 14.06,48.77 v13.81,48.9 | v10.89,52.58 v7.2,52.58 | v7.84,77.6 7.84,75.44 5.68,73.28 5.68,72.01 6.06,71.63 v6.06,69.22
ENC_R2  (via drill 0.3)
  Top 0.203: T100.16/A2 9.6,80.28 9.62,80.26 9.62,75.82 8.6,74.8 v8.6,69.72 | v6.57,64.64 6.57,63.88 5.55,62.87 5.55,61.21 v8.09,58.67 | v11.65,54.74 12.16,54.23 12.16,52.83 v12.47,52.51 | SW2.B 32.15,47.57 28.41,51.31 26.51,51.31 v26.38,51.44
  Bottom 0.203: v8.6,69.72 8.35,69.47 8.35,66.29 6.7,64.64 v6.57,64.64 | v8.09,58.67 8.09,58.29 v11.65,54.74 | v26.38,51.44 25.49,51.44 24.48,52.45 19.01,52.45 17.24,50.67 15.97,50.67 15.71,50.93 15.71,52.2 15.33,52.58 12.54,52.58 v12.47,52.51
GND  (via drill 0.3)
  Top 0.203: C16.1 v25.02,68.12 | R38.1 v29.27,63.75 | C19.1 v30.65,64.25 | C22.1 v34.4,64.75 | IC4.2 v35.4,68 | C21.1 v36.4,70.5 | v37.9,69 C24.- v37.9,71 37.92,71.02 C23.- v36.9,72.25 | C27.1 v32.4,80.25 | IC6.1 28.45,75.95 v28.4,76 | C18.1 v9.03,62.49 | C28.2 v31.73,86.06 | 28.96,44.69 U1.1 30.34,44.69 v30.4,44.75 | IC5.P$16 12.87,79.9 v12.9,79.88 | IC5.P$15 13.52,80 v13.65,79.88 | IC5.P$14 14.17,80.1 v14.4,79.88 | C25.- v21.4,78 | C20.1 v30.65,65.75 | IC5.P$5 15.47,76.2 v15.65,76.38 | IC5.P$6 16.12,76.1 v16.4,76.38 | R41.1 v5.4,68.37 5.1,68.33 T1.E | T2.E 5.1,71.83 v5.4,71.37 R42.1 | R40.1 5.4,65.12 v5.02,65.5 4.6,65.08 T3.E | R39.1 v10.15,64.75 | C17.1 v13.02,64.75 | C13.2 v13.65,66.75 | C14.2 v13.65,68 | R37.2 v13.65,70.25 | C15.2 v13.65,71.5 | C26.2 v13.65,72.75 | IC2.12 17.5,47.85 v17.65,48 17.65,48.5 | IC2.10 17.5,49.15 v17.65,49 17.65,48.5 | IC2.11 17.65,48.5 | IC2.5 21.75,49.15 v21.65,49 | IC2.3 21.8,47.85 v21.65,48 | C8.1 v24.65,45.5 | R12.2 v14.02,45.5 | C3.2 v14.02,44 | R11.2 v14.02,42.5 | R16.2 v2.65,46.25 | C5.1 v2.65,44.62 | R15.2 v2.02,42.5 | T4.E 4.45,81.7 R45.1 v4.65,82 | C4.1 v26.65,44.62 | C29.- v37.65,79.5 | C30.+ 37.31,92.72 v36.92,92.33 | C30.+ 37.65,94.2 v37.68,94.23 | C30.+ 37.65,92.36 v37.68,92.33 | C31.2 12.29,102.5 v12.28,102.49
  Bottom 0.203: v29.27,63.75 29.27,63.38 | v34.4,64.75 34.15,64.75 | v35.4,68 35.4,67.75 | v36.4,70.5 36.15,70.25 | v37.9,71 37.65,71 | v37.9,69 37.9,68.75 | v36.9,72.25 36.9,72 | v32.4,80.25 32.65,80.25 | v28.4,76 28.15,76 | v9.03,62.49 8.52,63 | v12.9,79.88 12.9,79.62 | v13.65,79.88 13.65,79.62 | v21.4,78 21.4,75.5 | v30.65,65.75 30.77,65.38 | v15.65,76.38 15.65,76.62 | v16.4,76.38 16.4,76.62 | v5.4,68.37 5.4,68.88 | v5.02,65.5 5.4,65.38 | v13.02,64.75 12.65,64.88 | v13.65,66.75 13.65,66.5 | v13.65,68 13.65,68.25 | v13.65,70.25 13.65,70.75 | v13.65,71.5 13.65,71.75 | v13.65,72.75 13.65,73 | v17.65,48 17.9,48.25 | v17.65,49 17.65,48.75 | v21.65,49 21.4,49.25 | v21.65,48 21.4,48 | v24.65,45.5 24.65,45.25 | v14.02,44 14.4,44 | v14.02,42.5 14.4,42.5 | v2.65,46.25 2.65,46.38 | v2.65,44.62 1.9,44.25 | v2.02,42.5 2.02,42.75 | v4.65,82 4.65,81.75 | v26.65,44.62 26.65,44.88 | v30.4,44.75 30.52,44.75 | v37.65,79.5 37.65,79.75 37.77,79.88 | v36.92,92.33 36.8,93.47 | v37.68,94.23 37.68,94.36 | v37.68,92.33 37.68,92.08 | v12.28,102.49 12.16,102.49
  pour Bottom: 54.71,112.15 -21.66,108.71 -21.02,-4.32 58.8,-8.57
IN_A  (via drill 0.3)
  Top 0.203: J7.TIP_B@1 4.65,26.12 7.27,28.75 v7.77,28.75 | v23.27,35.25 23.27,34.62 v20.9,32.25 | v23.27,38.5 21.65,40.12 R4.2 | v17.15,30.75 15.4,29 13.15,29 11.52,30.62 11.02,30.62 10.4,30 v10.4,28.75
  Bottom 0.203: v23.27,35.25 v23.27,38.5 | v7.77,28.75 v10.4,28.75 | v20.9,32.25 19.4,30.75 v17.15,30.75
IN_B  (via drill 0.3)
  Top 0.203: R18.2 20.15,44.75 20.02,44.62 20.02,41.12 22.52,38.62 22.52,38.25 25.15,35.62 v25.4,35.62 | 14.7,25.05 J5.TIP_B@1 15.22,25.62 15.27,25.62 15.27,26.5 v18.15,29.38 | v24.15,34.25 23.77,34.25 21.77,32.25 v21.77,31.25
  Bottom 0.203: v24.15,34.25 v25.4,35.62 | v18.15,29.38 19.9,29.38 v21.77,31.25
IN_C  (via drill 0.3)
  Top 0.203: R19.2 v19.15,44.12 | J6.TIP_B@1 24.65,27.62 21.9,30.38 21.52,30.38 18.9,33 18.02,33 16.65,34.38 16.65,37.12 17.27,37.88 17.27,42.25 v17.4,42.38
  Bottom 0.203: v17.4,42.38 v19.15,44.12
IN_D
  Top 0.203: R1.2 19.15,41.38 22.02,38.5 22.02,38 33.4,26.62 33.4,26.3 J8.TIP_B@1
N$1
  Top 0.203: S1.LEDNEG 29.65,65.75 R38.2
N$2
  Top 0.203: S2.LEDNEG 9.65,65.88 R39.2
N$3
  Top 0.203: S1.1 32.06,72.54 | 32.06,72.54 30.77,71.25 30.77,68.88 S1.2 32.19,65.83 C20.2 | 32.06,72.54 32.06,74.21 31.52,74.75 28.52,74.75 27.52,75.75 27.52,81.88 28.54,82.89 28.54,85.72 27.65,86.61 24.35,86.61 23.08,87.88 15.46,87.88 14.19,89.15 14.19,93.09 15.41,94.32 R46.1
N$4  (via drill 0.3)
  Top 0.203: S2.1 12.15,72.5 12.15,72.12 10.9,70.88 10.9,69.5 12.15,68.25 12.15,67.5 S2.2 12.4,67.25 C17.2 | v11.78,88.27 11.78,93.85 12.66,94.74 14.44,94.74 14.87,95.17 R47.1 | v10.89,77.34 10.89,84.58 v11.78,85.47
  Bottom 0.203: v11.78,85.47 v11.78,88.27 | v10.89,77.34 10.89,76.83 12.16,75.56 12.16,72.76 S2.1
N$6
  Top 0.203: R45.2 3.82,79.8 T4.B 2.95,79.5 2.65,79.5 0.52,77.38 0.52,63 0.9,62.62 0.9,58.5 0.52,58.12 0.52,51.24 0.9,50.86 R17.2
N$7  (via drill 0.3)
  Top 0.203: T3.B 4.95,62.92 | 4.95,62.92 4.95,63.17 R40.2 | 4.95,62.92 4.95,60.31 v7.12,58.13 | R9.2 15.02,43.25 15.4,43.62 15.4,49.93 14.53,50.8 13.17,50.8 11.52,52.45 11.52,53.68 v11.4,53.86
  Bottom 0.203: v7.12,58.13 v11.4,53.86
N$8
  Top 0.203: J11.TIP_T@3 2.6,40.05 0.9,41.75 R17.1
N$9
  Top 0.203: J9.TIP_T@3 14.65,41.5 R9.1
N$10  (via drill 0.3)
  Top 0.203: R41.2 4.95,66.42 T1.B 3.57,66.42 2.9,65.75 2.9,59.01 1.52,57.63 1.52,52.12 v3.15,50.5 | v11.02,49.88 11.9,49.88 14.06,47.71 v14.06,47.37 | R10.2 v24.65,43.88
  Bottom 0.203: v3.15,50.5 3.27,50.38 3.77,49.88 v11.02,49.88 | v24.65,43.88 24.02,43.88 21.52,46.38 15.06,46.38 v14.06,47.37
N$11
  Top 0.203: J10.TIP_T@3 R10.1
N$12  (via drill 0.3)
  Top 0.203: T2.B 4.95,69.92 R42.2 6.4,69.88 8.15,68.12 8.22,68.07 8.22,65.66 7.84,65.28 7.84,64.39 8.35,63.88 9.24,63.88 v10.63,63.88 | R14.2 34.65,45.12 35.52,45.99 v35.52,46.37 | v35.52,49 33.27,51.25 31.02,51.25 29.02,53.25 29.02,56.48 v27.14,58.37 | v24.9,58.62 24.16,57.88 18.15,57.88 v17.77,57.5 | v14.89,63.62 14.91,63.62 14.78,63.75 12.52,63.75 v12.4,63.88
  Bottom 0.203: v35.52,46.37 35.52,46.88 v35.52,49 | v27.14,58.37 25.29,58.37 24.98,58.67 v24.9,58.62 | v17.77,57.5 17.77,61.18 15.33,63.63 v14.89,63.62 | v10.63,63.88 v12.4,63.88
N$13
  Top 0.203: J12.TIP_T@3 R14.1
N$14
  Top 0.203: R28.2 C12.2 21.4,65.5 22.1,66.2 IC3.2 24.1,66.2 R36.1
N$15
  Top 0.203: R32.2 C12.1 22.15,64.5 22.15,65.25 22.45,65.55 IC3.1
N$16  (via drill 0.3)
  Top 0.203: v8.9,43.12 9.65,42.38 9.65,40.5 13.15,37 13.15,33.5 9.65,30 9.65,26.12 13.52,22.25 13.52,21 17.02,17.5 17.02,16.12 17.52,15.63 D1.- | v6.4,43.12 5.97,42.7 IC1.6 4.72,42.7 4.52,42.5 R15.1
  Bottom 0.203: v8.9,43.12 v6.4,43.12
N$17
  Top 0.203: IC3.6 21.6,68.8 21.15,69.25 C11.2 21.15,72 | R26.1 21.15,72 | 21.15,72 R30.2
N$18
  Top 0.203: IC3.7 22.2,69.45 21.9,69.75 21.9,70.5 C11.1 22.65,71.25 R33.2
N$19  (via drill 0.3)
  Top 0.203: v8.9,41.88 9.27,41.5 9.27,40.12 12.52,36.88 12.52,33.62 9.15,30.25 9.15,26 12.77,22.38 12.77,18.75 11.9,17.88 11.9,16 14.65,13.25 D1.+ | 6.4,41.75 v6.4,41.88 6.22,42.05 IC1.7
  Bottom 0.203: v8.9,41.88 v6.4,41.88
N$20
  Top 0.203: IC3.9 18.2,68.8 18.65,69.25 C10.2 18.65,71.75 R27.2 R24.1
N$21
  Top 0.203: R31.2 17.65,71.75 C10.1 17.9,70.5 17.9,69.75 17.6,69.45 IC3.8
N$22  (via drill 0.3)
  Top 0.203: IC1.9 12.2,42.7 R11.1 12.4,41.5 v12.02,41.12 | v20.77,28.25 21.02,28.25 21.52,27.75 21.52,23.62 27.15,18 27.15,13.62 D2.- | v15.15,29.62 13.52,29.62 v12.02,31.12
  Bottom 0.203: v20.77,28.25 16.52,28.25 v15.15,29.62 | v12.02,31.12 12.02,33 13.4,34.38 13.4,37.25 12.02,38.62 v12.02,41.12
N$23
  Top 0.203: R35.1 15.65,65.5 16.35,66.2 IC3.13 17.95,66.2 18.65,65.5 C9.2 R25.2
N$24
  Top 0.203: IC3.14 17.6,65.55 17.9,65.25 17.9,64.5 C9.1 R29.2
N$25
  Top 0.203: IC1.8 11.07,40.71 14.15,37.62 14.15,36.12 17.65,32.62 17.65,32.25 19.77,30.12 19.77,28.25 21.15,26.88 21.15,23.38 23.15,21.38 23.15,19 21.77,17.62 21.77,15 23.52,13.25 D2.+
N$26  (via drill 0.3)
  Top 0.203: R12.1 12.2,45.3 IC1.13 10.6,45.3 v10.02,45.88 | v9.15,39.12 9.02,39.12 6.9,37 6.9,33.88 7.77,33 8.27,33 v9.52,31.75 | v15.27,27.38 14.65,28 13.4,28 11.77,29.62 v11.52,29.62 | v16.4,26.62 v18.4,26.62 | v24.27,28.88 v27.02,28.88 | v28.65,28.88 28.4,28.88 28.4,27.38 37.65,18.12 37.65,13.38 D4.-
  Bottom 0.203: v10.02,45.88 10.02,45.75 10.9,44.88 10.9,40.88 v9.15,39.12 | v9.52,31.75 9.77,31.38 v11.52,29.62 | v15.27,27.38 15.65,27.38 v16.4,26.62 | v18.4,26.62 22.02,26.62 v24.27,28.88 | v27.02,28.88 v28.65,28.88
N$27
  Top 0.381: L1.1 37.24,74.11 C23.+ 34.65,71.52 C21.2 34.45,70.3 IC4.3 34.45,67.95 35.15,67.25 35.65,67.25 36.35,67.95 IC4.1
N$28
  Top 0.381: D5.1 37.65,88.99 36.16,87.5 25.36,87.5 J100.9 J100.10
N$29  (via drill 0.3)
  Top 0.203: 34.98,13.27 D4.+ 34.85,13.38 33.9,13.38 31.65,15.62 31.65,17.62 32.65,18.62 32.65,22.12 27.77,27 27.77,31.62 20.4,39 19.02,39 v18.15,39.88 | IC1.14 11.72,45.95 12.02,46.25 13.4,46.25 v13.52,46.38
  Bottom 0.203: v18.15,39.88 16.52,41.5 15.27,41.5 14.77,42 14.77,42.75 14.27,43.25 13.52,43.25 13.02,43.75 13.02,45.88 v13.52,46.38
N$30  (via drill 0.3)
  Top 0.203: IC2.7 21.95,50.45 21.65,50.75 21.65,51.25 C6.2 R22.2 25.27,52.5 25.9,53.12 25.9,59.88 25.4,60.37 25.4,62.45 v25.24,62.61 | R44.2 24.02,81.48 26.25,79.25 26.25,77.34 24.48,75.56 24.48,70.61 v24.35,70.48 | v26.38,63.75 26.38,64.9 28.41,66.93 28.41,68.07 27.52,68.96 v26.38,68.96
  Bottom 0.203: v25.24,62.61 v26.38,63.75 | v24.35,70.48 25.87,68.96 v26.38,68.96
N$31
  Top 0.203: IC2.1 22.2,46.55 21.9,46.25 21.9,45.5 C1.2 R5.2 22.15,43.5 R7.2
N$32
  Top 0.203: IC2.2 22.1,47.2 21.15,46.25 C1.1 R5.1 21.15,43.5 | 21.15,43.5 R4.1 | R2.1 21.15,43.5
N$33
  Top 0.203: IC2.6 21.35,49.8 20.9,50.25 C6.1 R22.1 20.9,53.25 R20.1 R18.1
N$35  (via drill 0.3)
  Top 0.203: IC2.8 17.35,50.45 17.65,50.75 17.65,51.25 C7.2 R23.2 14.15,52.5 13.4,53.25 13.4,56.75 14.27,57.62 v15.15,57.62 | R43.2 18.9,79.25 v18.77,79.12 | v17.65,78 13.68,78 10.78,75.1 10.78,73.88 10.77,73.12 10.77,72.25 9.77,71.25 9.77,69.12 10.77,68.12 10.77,66.38 10.52,66.12 10.52,65.38 11.28,64.62 11.28,63.99 12.02,63.25 14.41,63.25 v15.15,62.51
  Bottom 0.203: v18.77,79.12 v17.65,78 | v15.15,62.51 15.15,61.9 15.59,61.47 15.59,59.82 15.2,59.44 15.2,57.66 v15.15,57.62
N$37
  Top 0.203: IC2.9 17.95,49.8 18.4,50.25 C7.1 R23.1 18.4,53.25 R21.1 R19.1
N$38
  Top 0.203: IC2.14 17.1,46.55 17.4,46.25 17.4,45.5 C2.2 R6.2 R8.2
N$39
  Top 0.203: IC2.13 17.45,47.2 18.15,46.5 C2.1 R6.1 R3.1 R1.1
N$44  (via drill 0.3)
  Top 0.203: R16.1 3.85,45.3 IC1.2 5.28,45.25 v6.15,45.25 | v7.77,45.5 8.27,45 8.27,39.12 5.65,36.5 5.65,35.88 2.27,32.5 2.27,23.75 7.15,18.88 7.15,13.62 D3.-
  Bottom 0.203: v7.77,45.5 6.4,45.5 v6.15,45.25
N$64
  Top 0.381: D6.2 36.77,103 36.29,102.51 36.29,98.42 33.79,95.93 J100.2 J100.1
N$77
  Top 0.203: IC1.1 6.32,45.95 7.65,44.62 7.65,39.25 4.9,36.5 4.9,35.75 1.77,32.62 1.77,23.5 2.9,22.38 2.9,18.38 2.02,17.5 2.02,14.5 3.27,13.25 D3.+
OFFSET  (via drill 0.3)
  Top 0.381: R13.2 27.71,42.81 U1.2 29.44,42.75 32.9,42.75 33.77,43.62 v33.77,45 | C4.2 R13.2 | R3.2 18.15,41.25 v18.4,41 | v21.02,41 21.02,41.12 20.65,41.5 R2.2 | R13.2 27.65,42.12 27.15,41.62 26.27,41.62 v25.9,42 | R21.2 18.27,54.88 18.77,55.38 20.65,55.38 21.15,54.88 R20.2 21.15,56.75 21.77,57.38 25.15,57.38 v25.27,57.5 | v33.9,47 33.9,49 33.02,49.88 31.27,49.88 27.9,53.25 27.9,55 27.15,55.75 v27.15,56.88
  Bottom 0.381: v18.4,41 v21.02,41 21.15,41 22.15,42 v25.9,42 | v33.9,47 33.9,45.12 v33.77,45 | v25.27,57.5 26.52,57.5 v27.15,56.88
OUT_A  (via drill 0.3)
  Top 0.203: R25.1 R29.1 16.4,60.75 v14.41,60.75 | J3.TIP_B@1 4.65,5.88 1.4,9.12 1.4,17.88 2.4,18.88 2.4,22.12 1.15,23.38 1.15,32.75 4.15,35.75 4.15,36.5 7.02,39.38 7.02,44 6.37,44.65 | IC1.3 6.37,44.65 | 6.37,44.65 6.37,44.23 v6.27,44.12 | v5.02,47.12 5.02,48.24 6.65,49.86 6.65,51.86 6.44,52.07 6.44,53.47 6.7,53.72 6.7,56.39 8.73,58.42 v8.73,60.07
  Bottom 0.203: v6.27,44.12 5.27,44.12 5.02,44.38 v5.02,47.12 | v8.73,60.07 8.98,60.33 13.98,60.33 v14.41,60.75
OUT_B  (via drill 0.3)
  Top 0.203: R27.1 R31.1 | J1.TIP_B@1 14.65,5.75 18.9,10 18.9,16.38 14.52,20.75 14.52,22 11.27,25.25 v11.27,25.62 | v4.27,43.25 4.42,43.35 IC1.5 1.8,43.35 1.52,43.62 1.52,47.75 6.02,52.25 v6.02,55.5 | v1.4,40.12 1.4,39 3.4,37 v3.4,36.12 | v5.15,34.25 5.9,34.25 8.52,31.62 8.52,25.62 v9.27,24.88 | v7.77,55.5 7.9,55.5 12.83,60.43 13.28,60.43 14.22,61.38 15.91,61.38 16.41,61.88 v16.41,64.62 | v16.4,70.38 16.52,70.5 16.52,71.04 16.73,71.25 16.73,72.2 R31.1 | 17.3,72.77 R31.1
  Bottom 0.203: v4.27,43.25 4.27,43 v1.4,40.12 | v3.4,36.12 3.4,36 v5.15,34.25 | v9.27,24.88 10.52,24.88 v11.27,25.62 | v7.77,55.5 v6.02,55.5 | v16.4,70.38 16.4,65.12 v16.41,64.62
OUT_C  (via drill 0.3)
  Top 0.203: R32.1 R28.1 21.27,61.88 v21.27,60.5 | J2.TIP_B@1 24.65,5.62 20.15,10.12 20.15,15.88 16.65,19.38 16.65,22.25 19.02,24.62 19.02,30 17.15,31.88 17.15,32.38 13.65,35.88 13.65,37.25 10.15,40.75 10.15,43.12 10.34,43.31 | 10.34,43.31 10.37,43.35 IC1.10 | v21.27,59 21.3,59 21.05,58.75 13.77,58.75 9.65,54.62 9.65,49.88 8.27,48.5 8.27,46 8.77,45.5 8.77,44.12 9.55,43.35 10.3,43.35 10.34,43.31
  Bottom 0.203: v21.27,59 v21.27,60.5
OUT_D  (via drill 0.3)
  Top 0.203: R33.1 R30.1 v22.15,73.38 | J4.TIP_B@1 34.65,5.88 28.9,11.62 28.9,17 22.15,23.75 22.15,28.75 v18.52,32.38 | v16.02,35.38 16.02,38.25 16.9,39.12 16.9,40.75 16.15,41.5 v16.15,43.12 | IC1.12 11.09,44.62 11.77,44.62 11.9,44.75 v14.65,44.75 14.65,49.83 v14.32,50.16 | v20.15,71.12 20.15,69.25 v20.65,68.75 | v20.77,67.38 20.77,61.12 v19.77,60.12 | v16.52,51.62 v15.15,51.62
  Bottom 0.203: v18.52,32.38 18.02,32.38 16.02,34.38 v16.02,35.38 | v22.15,73.38 22.15,73.12 v20.15,71.12 | v20.65,68.75 20.65,67.5 v20.77,67.38 | v19.77,60.12 19.77,54.63 16.77,51.62 v16.52,51.62 | v14.65,44.75 14.65,44.62 v16.15,43.12 | v15.15,51.62 15.01,51.62 14.32,50.93 v14.32,50.16
RST  (via drill 0.3)
  Top 0.203: OLED1.P$5 22.19,103.12 21.43,102.36 16.73,102.36 16.09,101.73 v15.46,101.73
  Bottom 0.203: T100.7 14.68,100.94 v15.46,101.73
RST_DAC  (via drill 0.3)
  Top 0.203: IC5.P$13 14.82,81.79 14.32,82.3 v11.65,82.3 | v9.62,94.61 9.62,88.9 v10.25,88.27
  Bottom 0.203: T100.9 9.6,95.02 v9.62,94.61 | v10.25,88.27 10.89,87.63 10.89,83.06 v11.65,82.3
SCK  (via drill 0.3)
  Top 0.203: IC5.P$10 16.77,82.12 16.02,82.88 14.12,82.88 13.43,83.57 v13.43,85.09 | OLED1.P$3 16.58,104.75 v14.82,103 | v13.43,93.98 v13.43,88.01 | T100.13 1.98,92.94 5.17,96.14 6.82,96.14 7.08,96.39 13.55,96.39 13.68,96.52 v13.68,96.65
  Bottom 0.203: v13.43,85.09 v13.43,88.01 | v14.82,103 14.82,102.49 13.43,101.09 13.43,96.9 | 13.43,96.9 v13.43,93.98 | v13.68,96.65 13.43,96.9
SW_B  (via drill 0.3)
  Top 0.203: v22.32,95.25 21.3,95.32 R47.2
  Bottom 0.203: T100.4 22.3,95.27 v22.32,95.25
SW_L  (via drill 0.3)
  Top 0.203: SW1.E 11.15,63 C18.2 10.52,62.88 v9.74,62.1 | T100.23/A9 27.38,84.86 26.13,86.11 22.95,86.11 22.57,86.49 17.87,86.49 17.49,86.11 10,86.11 8.6,84.71 8.6,83.05 9.24,82.41 9.24,76.07 8.22,75.06 8.22,71.5 7.9,71.18 7.9,69.38 8.6,68.68 v8.6,64.64
  Bottom 0.203: v9.74,62.1 9.74,62.99 8.98,63.75 8.98,64.26 v8.6,64.64
SW_R  (via drill 0.3)
  Top 0.203: SW2.E 32.27,62.12 C19.2 32.85,64.25 33.49,64.9 33.49,72.64 36.16,75.31 36.16,76.58 v36.03,76.71 | v36.16,80.9 36.16,85.47 v36.29,85.6 | v36.29,89.79 36.29,94.36 v36.16,94.49 | v32.6,94.61 32.6,95.25 v31.08,96.77 | v31.08,100.58 18.63,100.58 18.51,100.46 14.44,100.46 13.43,99.44 13.43,98.81 12.79,98.17 4.16,98.17 0.6,94.61 0.6,93.47 v0.73,93.34 | v3.65,87.12 3.65,84.88 T100.14/A0
  Bottom 0.203: v36.03,76.71 36.03,80.77 v36.16,80.9 | v36.29,85.6 36.29,85.98 37.43,87.12 37.43,88.65 v36.29,89.79 | v36.16,94.49 32.73,94.49 v32.6,94.61 | v31.08,96.77 v31.08,100.58 | v0.73,93.34 0.73,90.04 v3.65,87.12
SW_T  (via drill 0.3)
  Top 0.203: v19.9,94.23 19.2,94.23 R46.2
  Bottom 0.203: T100.5 19.76,94.38 v19.9,94.23
TR1
  Top 0.203: T4.C 1.05,81.41 | 1.05,81.41 1.05,81.85 | T100.0 32.46,98.28 31.71,97.54 13.55,97.54 13.05,97.03 5.3,97.03 0.98,92.71 0.98,81.48 1.05,81.41
TR2  (via drill 0.3)
  Top 0.203: T3.C 1.8,65.47 0.9,66.38 0.9,75.75 5.68,80.53 5.68,87 3.01,89.66 v3.01,92.96 | T100.1 29.92,98.53 29.43,98.04 13.3,98.04 12.92,97.66 4.92,97.66 v1.62,94.36
  Bottom 0.203: v1.62,94.36 v3.01,92.96
TR3  (via drill 0.3)
  Top 0.203: T1.C 1.92,69.15 3.02,70.25 3.02,73.38 3.65,74 6.15,74 8.47,76.33 8.6,81.81 8.22,82.19 8.22,86.87 6.82,88.27 6.82,94.74 7.58,95.5 14.57,95.5 15.2,96.14 25.49,96.14 26.13,96.77 v27.4,96.77
  Bottom 0.203: T100.2 27.38,96.79 v27.4,96.77
TR4  (via drill 0.3)
  Top 0.203: T2.C 1.27,71.53 1.27,75.5 6.06,80.29 6.06,94.74 7.2,95.89 14.19,95.89 15.08,96.77 v24.73,96.77
  Bottom 0.203: T100.3 24.84,96.88 v24.73,96.77
V_BIAS
  Top 0.203: IC3.3 21.8,66.85 21.65,67 21.65,68 21.8,68.15 | IC3.5 21.8,68.15 | R37.1 R34.2 C14.1 15.55,68.15 IC3.10 18.65,68.15 | 18.65,68.15 21.8,68.15 | IC3.12 18.25,66.85 18.65,67.25 18.65,68.15
VREF_2V5
  Top 0.203: R34.1 C15.1 C26.1 15.4,73.25 14.17,74.47 IC5.P$3